# EAGLE design uprom (EAGLE 9.6.0)
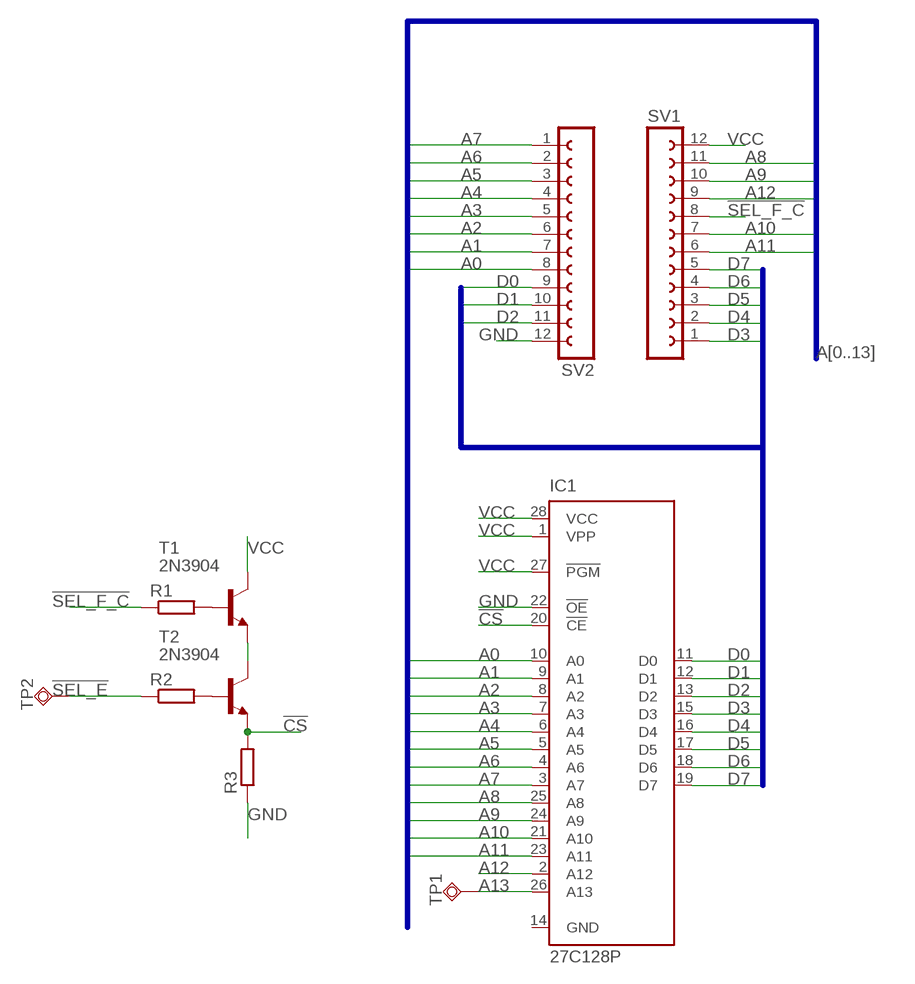
[diagram p0: schematic, sheet 1]

## Parts
IC1  27C128P  [DIL28-6]
R1  R-EU_0207/7  [0207/7]
R2  R-EU_R1206  [R1206]
R3  R-EU_R1206  [R1206]
SV1  FE12-1  [FE12]
SV2  FE12-1  [FE12]
T1  2N3904  [TO92]
T2  2N3904  [TO92]
TP1  TPSQTP16R  [TP16R]
TP2  TPSQTP16R  [TP16R]

## Nets
!CS: IC1.20(!CE) R3.2 T2.3(E)
!SEL_E: R2.1 TP2.TP
!SEL_F_C: R1.1 SV1.8
A0: IC1.10(A0) SV2.8
A1: IC1.9(A1) SV2.7
A2: IC1.8(A2) SV2.6
A3: IC1.7(A3) SV2.5
A4: IC1.6(A4) SV2.4
A5: IC1.5(A5) SV2.3
A6: IC1.4(A6) SV2.2
A7: IC1.3(A7) SV2.1
A8: IC1.25(A8) SV1.11
A9: IC1.24(A9) SV1.10
A10: IC1.21(A10) SV1.7
A11: IC1.23(A11) SV1.6
A12: IC1.2(A12) SV1.9
A13: IC1.26(A13) TP1.TP
D0: IC1.11(D0) SV2.9
D1: IC1.12(D1) SV2.10
D2: IC1.13(D2) SV2.11
D3: IC1.15(D3) SV1.1
D4: IC1.16(D4) SV1.2
D5: IC1.17(D5) SV1.3
D6: IC1.18(D6) SV1.4
D7: IC1.19(D7) SV1.5
GND: IC1.22(!OE) R3.1 SV2.12
N$1: R1.2 T1.2(B)
N$2: R2.2 T2.2(B)
N$3: T1.3(E) T2.1(C)
VCC: IC1.1(VPP) IC1.27(!PGM) IC1.28(VCC) SV1.12 T1.1(C)

## Buses
A[0..13]
D[0..7]

## Power pins joined to a net without a drawn wire
GND: IC1.14(GND)

## Library data of the parts
IC1 = microchip:27*128: CMOS EPROM 128 K (16 K x 8); OC_FARNELL: unknown; OC_NEWARK: unknown
R1-R3 = rcl:R-EU_: RESISTOR, European symbol; SPICEPREFIX: R
SV1 SV2 = con-lsta:FE12-1: FEMALE HEADER; OC_FARNELL: unknown; OC_NEWARK: unknown
T1 T2 = transistor-neu-to92:2N3904: NPN TRANSISTOR
TP1 TP2 = testpad:TPSQ: Test pad

## Board
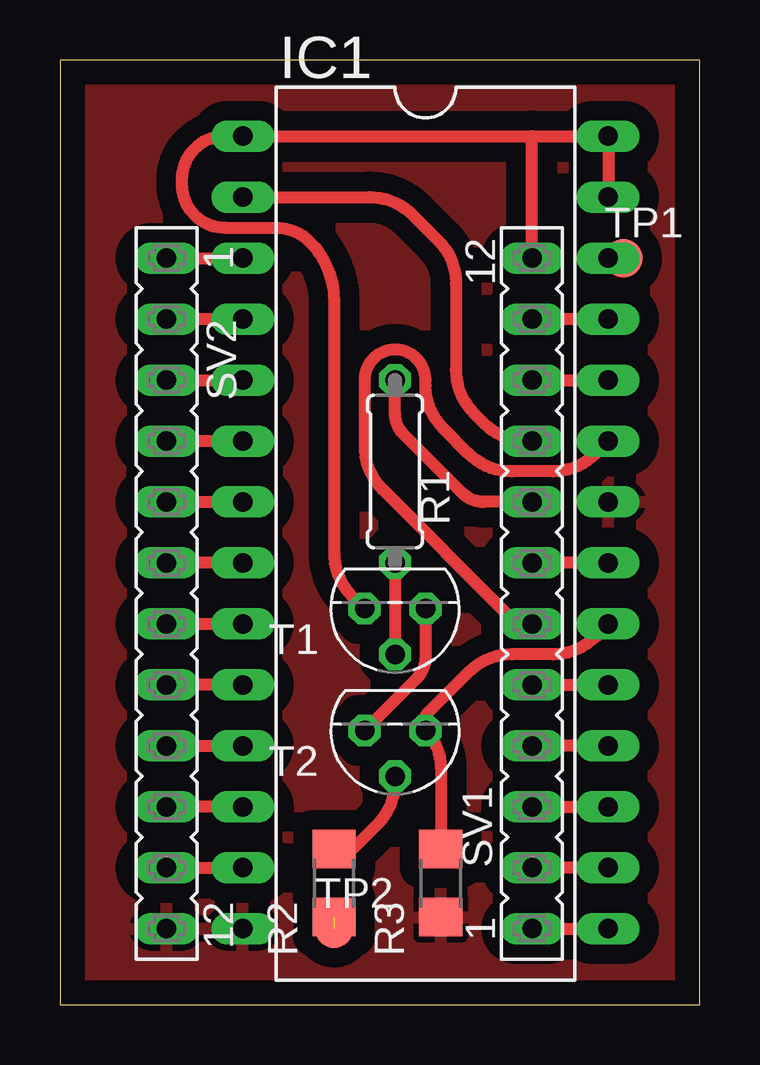
[diagram p1: board, top side]

Size 26.67 x 39.37 mm. Coordinates in mm from the lower left corner, seen from the top.
Outline: 0,0 26.67,0 26.67,39.37 0,39.37 0,0
Copper layers (1*16): Top 0.035mm / dielectric 1.5mm / Bottom 0.035mm
Design rules "default": minimum track width 6mil, minimum drill 0.35mm, track to track 6mil, track to pad 6mil, pad to pad 6mil, via to via 6mil, smd to smd 6mil, copper to edge 40mil, drill to drill 6mil, minimum pad ring 10mil, minimum via ring 8mil, stop-mask expansion 4mil, vias tented up to drill 0mil, thermal gap 10mil

### Footprints (pad centres in the part's own frame; a part is rotated, then mirrored left to right if it is on the bottom)
DIL28-6 = drill 0.813 long: 1 -16.51,-7.62; 2 -13.97,-7.62; 3 -11.43,-7.62; 4 -8.89,-7.62; 5 -6.35,-7.62; 6 -3.81,-7.62; 7 -1.27,-7.62; 8 1.27,-7.62; 9 3.81,-7.62; 10 6.35,-7.62; 11 8.89,-7.62; 12 11.43,-7.62; 13 13.97,-7.62; 14 16.51,-7.62; 15 16.51,7.62; 16 13.97,7.62; 17 11.43,7.62; 18 8.89,7.62; 19 6.35,7.62; 20 3.81,7.62; 21 1.27,7.62; 22 -1.27,7.62; 23 -3.81,7.62; 24 -6.35,7.62; 25 -8.89,7.62; 26 -11.43,7.62; 27 -13.97,7.62; 28 -16.51,7.62
0207/7 = drill 0.813 octagon: 1 -3.81,0; 2 3.81,0
R1206 = smd 1.6 x 1.803: 1 -1.422,0; 2 1.422,0
FE12 = drill 0.813 long: 1 -13.97,0; 2 -11.43,0; 3 -8.89,0; 4 -6.35,0; 5 -3.81,0; 6 -1.27,0; 7 1.27,0; 8 3.81,0; 9 6.35,0; 10 8.89,0; 11 11.43,0; 12 13.97,0
TO92 = drill 0.813 octagon: 1 1.27,0; 2 0,1.905; 3 -1.27,0
TP16R = smd 1.6 x 1.6: TP 0,0

### Placement (x,y rotation side)
IC1  15.24,19.69 270 top
R1  13.97,22.23 270 top
R2  11.43,5.08 90 top
R3  15.88,5.08 90 top
SV1  19.68,17.14 90 top
SV2  4.45,17.14 270 top
T1  13.97,16.51 180 top
T2  13.97,11.43 180 top
TP1  23.5,31.11 0 top
TP2  11.43,3.17 0 top

### Tracks (layer width: path | path; a pad name or v marks a point on that pad's centre or on a via)
!CS
  Top 0.508: IC1.20 22.33,15.35 arc-45 20.54,14.6 18.83,14.6 arc45 17.04,13.86 15.24,12.06 T2.3 arc-45 15.88,9.9 R3.2
!SEL_E  (1 unrouted)
!SEL_F_C
  Top 0.508: SV1.8 17.67,20.95 arc-45 16.77,21.33 14.34,23.76 arc-45 13.97,24.66 R1.1
A0
  Top 0.508: IC1.10 SV2.8
A1
  Top 0.508: SV2.7 IC1.9
A2
  Top 0.508: IC1.8 SV2.6
A3
  Top 0.508: SV2.5 IC1.7
A4
  Top 0.508: IC1.6 SV2.4
A5
  Top 0.508: SV2.3 IC1.5
A6
  Top 0.508: IC1.4 SV2.2
A7
  Top 0.508: SV2.1 IC1.3
A8
  Top 0.508: IC1.25 SV1.11
A9
  Top 0.508: SV1.10 IC1.24
A10
  Top 0.508: IC1.21 SV1.7
A11
  Top 0.508: IC1.23 22.33,22.97 arc-45 20.54,22.23 18.83,22.23 arc-45 17.04,22.97 15.98,24.02 arc-45 15.24,25.82 15.24,26.03 arc90 13.97,27.3 arc90 12.7,26.03 12.7,23.28 arc45 13.44,21.48 18.6,16.32 arc45 SV1.6
A12
  Top 0.508: IC1.2 12.92,33.65 arc-45 14.71,32.91 15.77,31.86 arc-45 16.51,30.06 16.51,26.45 arc45 17.25,24.66 17.67,24.24 arc45 19.47,23.49 SV1.9
A13
  Top 0.508: IC1.26 TP1.TP
D0
  Top 0.508: SV2.9 IC1.11
D1
  Top 0.508: IC1.12 SV2.10
D2
  Top 0.508: SV2.11 IC1.13
D3
  Top 0.508: SV1.1 IC1.15
D4
  Top 0.508: IC1.16 SV1.2
D5
  Top 0.508: SV1.3 IC1.17
D6
  Top 0.508: IC1.18 SV1.4
D7
  Top 0.508: SV1.5 IC1.19
GND
  pour Top (isolate 0.813): 0,39.37 26.67,39.37 26.67,0 0,0
N$1
  Top 0.508: R1.2 T1.2
N$2
  Top 0.508: T2.2 13.97,9.31 arc-45 13.23,7.51 12.22,6.5 R2.2
N$3
  Top 0.508: T1.3 15.24,14.5 arc-45 14.87,13.6 T2.1
VCC
  Top 0.508: IC1.27 IC1.28 19.68,36.2 | 19.68,36.2 IC1.1 6.88,36.2 arc45 5.61,35.67 arc45 5.08,34.4 5.08,34.18 arc45 5.61,32.91 arc45 6.88,32.38 9,32.38 arc-45 10.4,31.8 arc-45 11.43,29.32 11.43,18.83 arc45 12.17,17.04 T1.1 | SV1.12 19.68,36.2